# EAGLE design IO Shield (EAGLE 6.4)
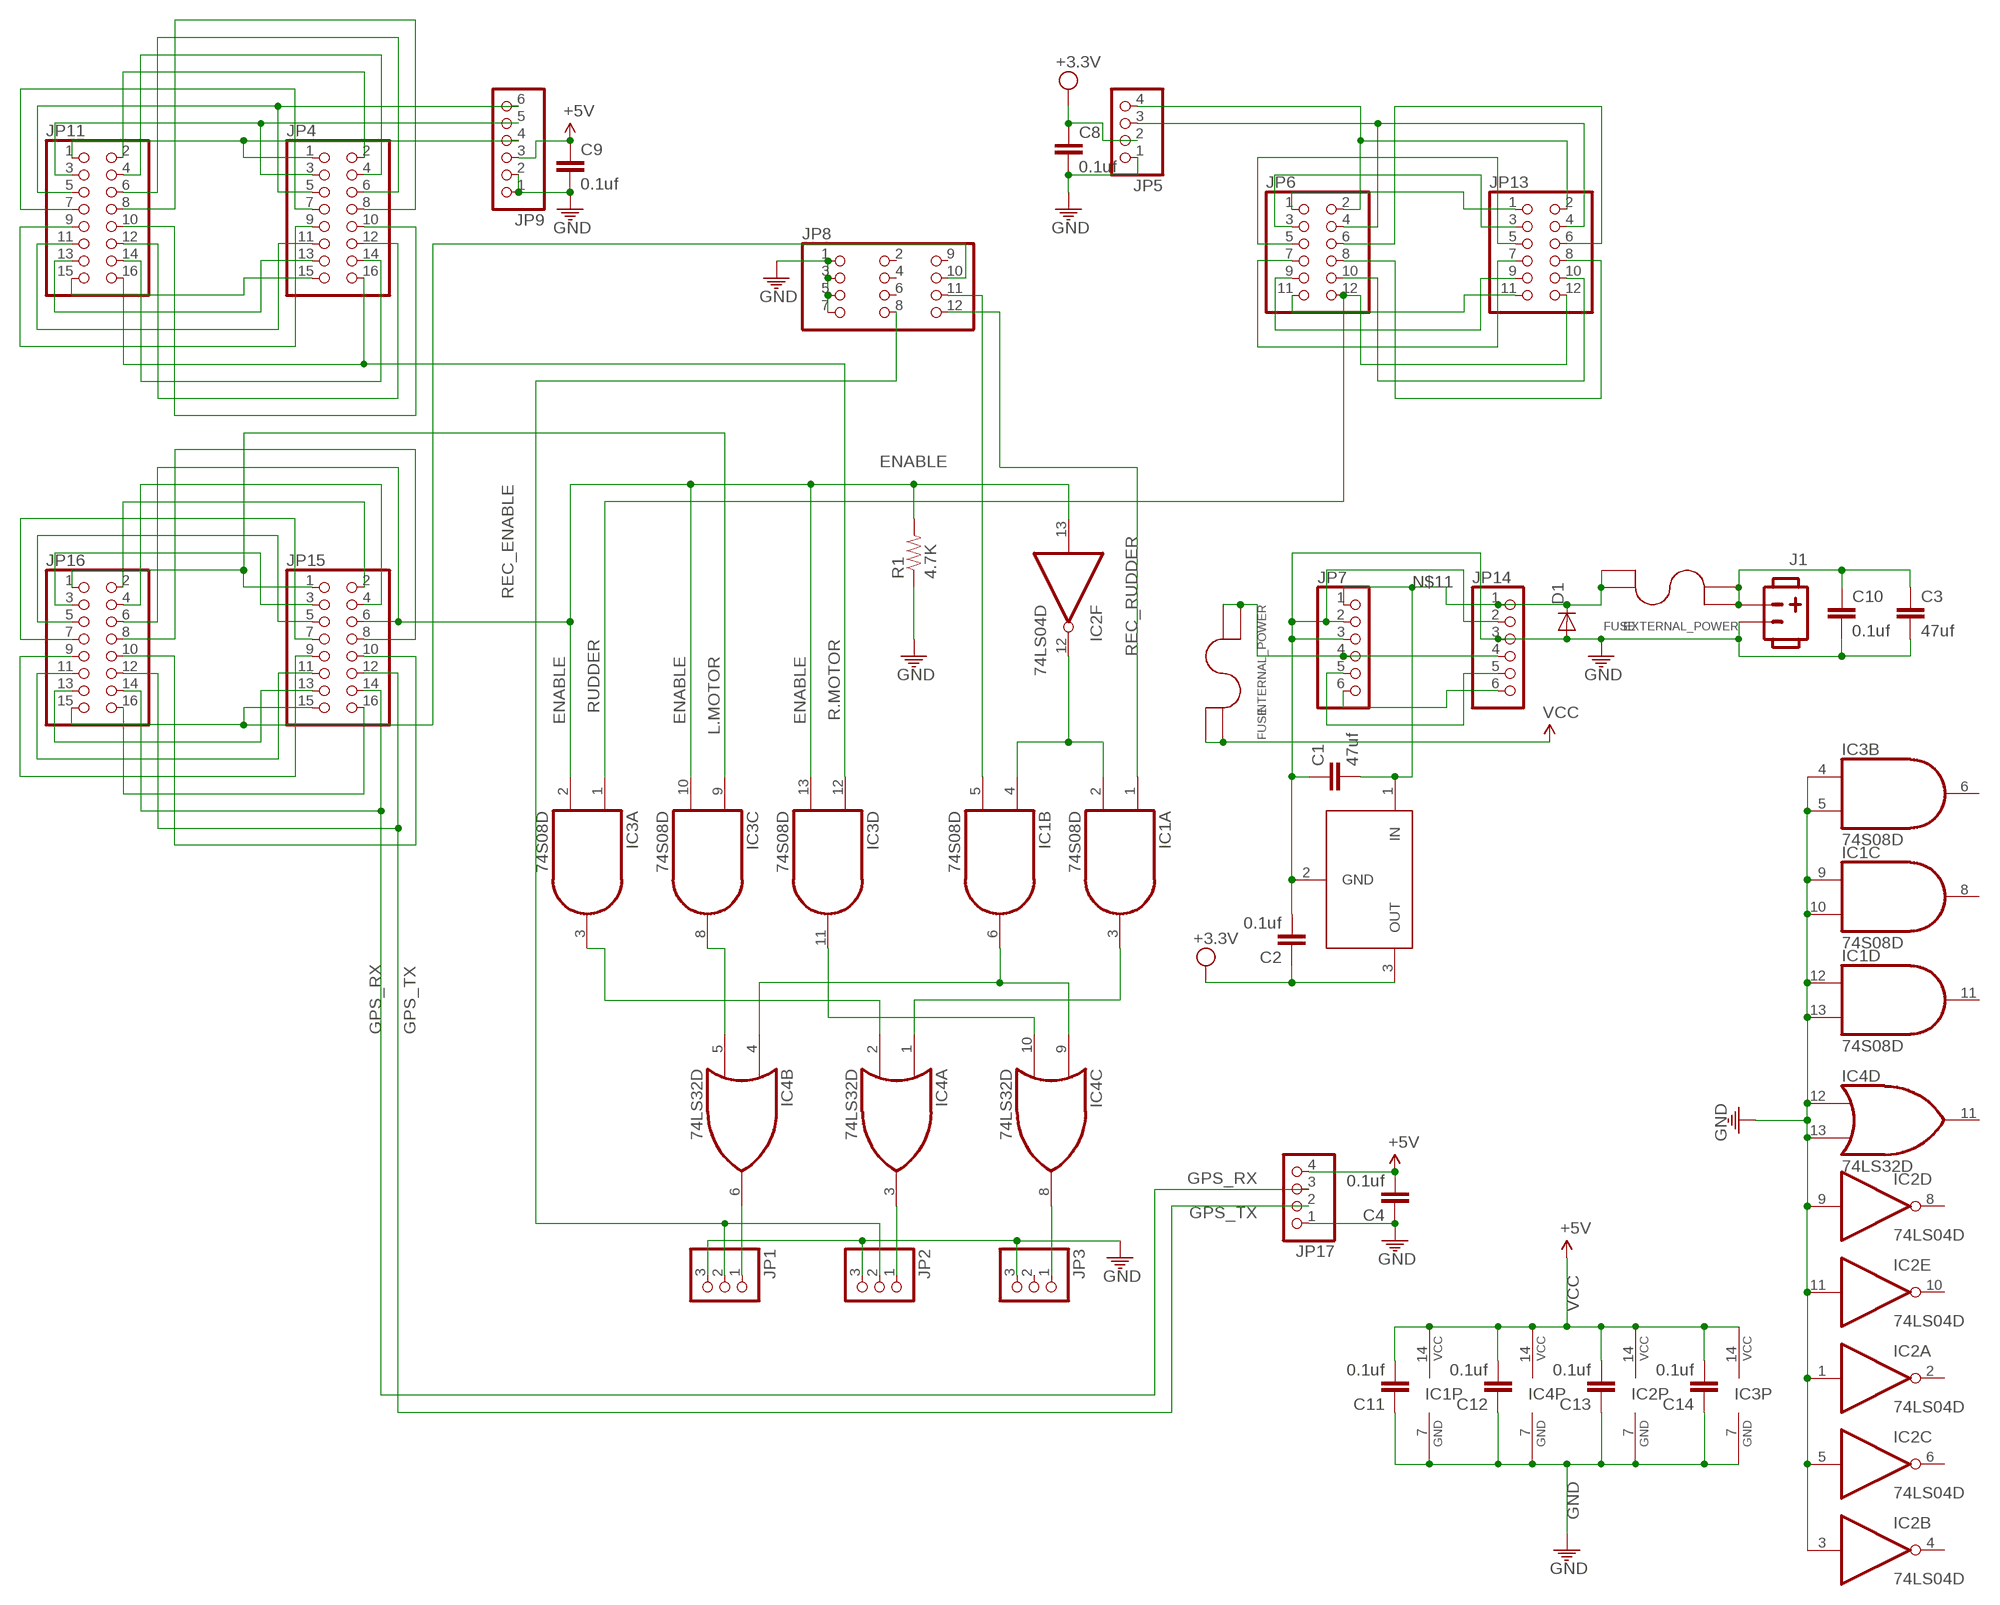
[diagram p0: schematic, sheet 1]

## Parts
C1  47uf  C-EUC0805  [C0805]
C2  0.1uf  C-EUC0805  [C0805]
C3  47uf  C-EUC0805  [C0805]
C4  0.1uf  C-EUC0805  [C0805]
C8  0.1uf  C-EUC0805  [C0805]
C9  0.1uf  C-EUC0805  [C0805]
C10  0.1uf  C-EUC0805  [C0805]
C11  0.1uf  C-EUC0805  [C0805]
C12  0.1uf  C-EUC0805  [C0805]
C13  0.1uf  C-EUC0805  [C0805]
C14  0.1uf  C-EUC0805  [C0805]
D1  DIODEPTH  [DIODE-1N4001]
EXTERNAL_POWER  FUSE  [FUSE_2AG]
IC1  74S08D  [SO14]
IC2  74LS04D  [SO14]
IC3  74S08D  [SO14]
IC4  74LS32D  [SO14]
INTERNAL_POWER  FUSE  [FUSE_2AG]
J1  POW_CONNECTFEMALE-RA  [SOCKET-FEMALE_RA-3.96MM-2]
JP1  PINHD-1X3/90  [1X03/90]
JP2  PINHD-1X3/90  [1X03/90]
JP3  PINHD-1X3/90  [1X03/90]
JP4  PINHD-2X8  [2X08]
JP5  PINHD-1X4  [1X04]
JP6  PINHD-2X6  [2X06]
JP7  PINHD-1X6  [1X06]
JP8  PINHD-2X4  [2X04]
JP9  PINHD-1X6  [1X06]
JP11  PINHD-2X8  [2X08]
JP13  PINHD-2X6  [2X06]
JP14  PINHD-1X6  [1X06]
JP15  PINHD-2X8  [2X08]
JP16  PINHD-2X8  [2X08]
JP17  PINHD-1X4  [1X04]
R1  4.7K  RESISTOR0805-RES  [0805]
U$1  LM3940IMP-3.3  [SOT223]

## Nets
ENABLE: IC2.13(F:I) IC3.2(A:I1) IC3.10(C:I1) IC3.13(D:I1) JP15.6 JP16.6 R1.2
GND: C1.1 C2.2 C3.2 C4.1 C8.2 C9.2 C10.2 C11.1 C12.1 C13.1 C14.1 D1.A IC1.7(P:GND) IC1.9(C:I0) IC1.10(C:I1) IC1.12(D:I0) IC1.13(D:I1) IC2.1(A:I) IC2.3(B:I) IC2.5(C:I) IC2.7(P:GND) IC2.9(D:I) IC2.11(E:I) IC3.4(B:I0) IC3.5(B:I1) IC3.7(P:GND) IC4.7(P:GND) IC4.12(D:I0) IC4.13(D:I1) J1.2 JP1.3 JP2.3 JP3.3 JP5.1 JP7.2 JP7.3 JP8.1 JP8.3 JP8.5 JP8.7 JP9.1 JP9.2 JP14.2 JP14.3 JP17.1 R1.1 U$1.2(GND)
GPS_RX: JP15.14 JP16.14 JP17.3
GPS_TX: JP15.12 JP16.12 JP17.2
L.MOTOR: IC3.9(C:I0) JP15.1 JP16.1
N$1: IC1.3(A:O) IC4.1(A:I0)
N$2: IC1.6(B:O) IC4.4(B:I0) IC4.9(C:I0)
N$3: IC1.2(A:I1) IC1.4(B:I0) IC2.12(F:O)
N$4: JP4.1 JP9.4 JP11.1
N$5: IC3.11(D:O) IC4.10(C:I1)
N$6: IC3.8(C:O) IC4.5(B:I1)
N$7: IC3.3(A:O) IC4.2(A:I1)
N$8: IC4.6(B:O) JP1.1
N$9: IC4.3(A:O) JP2.1
N$10: IC4.8(C:O) JP3.1
N$11: C1.2 D1.C EXTERNAL_POWER.P$3 EXTERNAL_POWER.P$4 JP7.1 JP14.1 U$1.1(IN)
N$12: JP1.2 JP2.2 JP8.8
N$13: C3.1 C10.1 EXTERNAL_POWER.P$1 EXTERNAL_POWER.P$2 J1.1
N$14: JP8.10 JP15.15 JP16.15
N$15: JP6.1 JP13.1
N$17: JP4.3 JP9.5 JP11.3
N$18: JP4.5 JP9.6 JP11.5
N$19: JP4.7 JP11.7
N$20: JP4.15 JP11.15
N$21: JP4.13 JP11.13
N$22: JP4.11 JP11.11
N$23: JP4.9 JP11.9
N$24: JP4.2 JP11.2
N$25: JP4.4 JP11.4
N$26: JP4.6 JP11.6
N$27: JP4.8 JP11.8
N$28: JP4.14 JP11.14
N$29: JP4.12 JP11.12
N$30: JP4.10 JP11.10
N$31: JP6.3 JP13.3
N$32: JP15.3 JP16.3
N$33: JP15.5 JP16.5
N$34: JP15.7 JP16.7
N$36: JP15.13 JP16.13
N$37: JP15.11 JP16.11
N$38: JP15.9 JP16.9
N$39: JP15.2 JP16.2
N$40: JP15.4 JP16.4
N$41: JP6.5 JP13.5
N$42: JP15.8 JP16.8
N$44: INTERNAL_POWER.P$1 INTERNAL_POWER.P$2 JP7.4 JP14.4
N$45: JP15.10 JP16.10
N$46: JP6.7 JP13.7
N$47: JP6.9 JP13.9
N$48: JP6.11 JP13.11
N$49: JP5.4 JP6.2 JP13.2
N$50: JP5.3 JP6.4 JP13.4
N$51: JP6.6 JP13.6
N$52: JP6.8 JP13.8
N$53: JP6.10 JP13.10
N$58: JP7.5 JP14.5
N$59: JP7.6 JP14.6
R.MOTOR: IC3.12(D:I0) JP4.16 JP11.16
REC.MOTOR: IC1.5(B:I1) JP8.11
REC_ENABLE: JP15.16 JP16.16
REC_RUDDER: IC1.1(A:I0) JP8.12
RUDDER: IC3.1(A:I0) JP6.12 JP13.12
VCC: C4.2 C9.1 C11.2 C12.2 C13.2 C14.2 IC1.14(P:VCC) IC2.14(P:VCC) IC3.14(P:VCC) IC4.14(P:VCC) INTERNAL_POWER.P$3 INTERNAL_POWER.P$4 JP9.3 JP17.4 ; supply symbol labelled +5V
VDD: C2.1 C8.1 JP5.2 U$1.3(OUT) ; supply symbol labelled +3.3V
Unconnected: IC1.8(C:O) IC1.11(D:O) IC2.2(A:O) IC2.4(B:O) IC2.6(C:O) IC2.8(D:O) IC2.10(E:O) IC3.6(B:O) IC4.11(D:O) JP3.2 JP8.2 JP8.4 JP8.6 JP8.9

## Library data of the parts
C1-C4 C8-C14 = resistor:C-EU: CAPACITOR, European symbol
D1 = ASL:DIODE: Diode These are standard reverse protection diodes and small signal diodes. SMA package can handle up to about 1A. SOD-323 can handle about 200mA. What the SOD-323 package when ordering, there are some mfgs out there that are 5-pin packages.
EXTERNAL_POWER INTERNAL_POWER = ASL:FUSE
IC1 IC3 = 74xx-us:74*08: Quad 2-input AND gate
IC2 = 74xx-us:74*04: Hex INVERTER
IC4 = 74xx-us:74*32: Quad 2-input OR gate
J1 = ASL:POW_CONNECT
JP1-JP3 = pinhead:PINHD-1X3: PIN HEADER
JP4 JP11 JP15 JP16 = pinhead:PINHD-2X8: PIN HEADER
JP5 = SDLogger:PINHD-1X4: PIN HEADER
JP6 JP13 = pinhead:PINHD-2X6: PIN HEADER
JP7 JP14 = pinhead:PINHD-1X6: PIN HEADER
JP8 = pinhead:PINHD-2X4: PIN HEADER
JP9 = SDLogger:PINHD-1X6: PIN HEADER
JP17 = pinhead:PINHD-1X4: PIN HEADER
R1 = ASL:RESISTOR: Resistor Basic schematic elements and footprints for 0603, 1206, and PTH resistors.
U$1 = LM3940:LM3940IMP-3.3: 1A Low Dropout Regulator for 5V to 3.3V Conversion

## Board
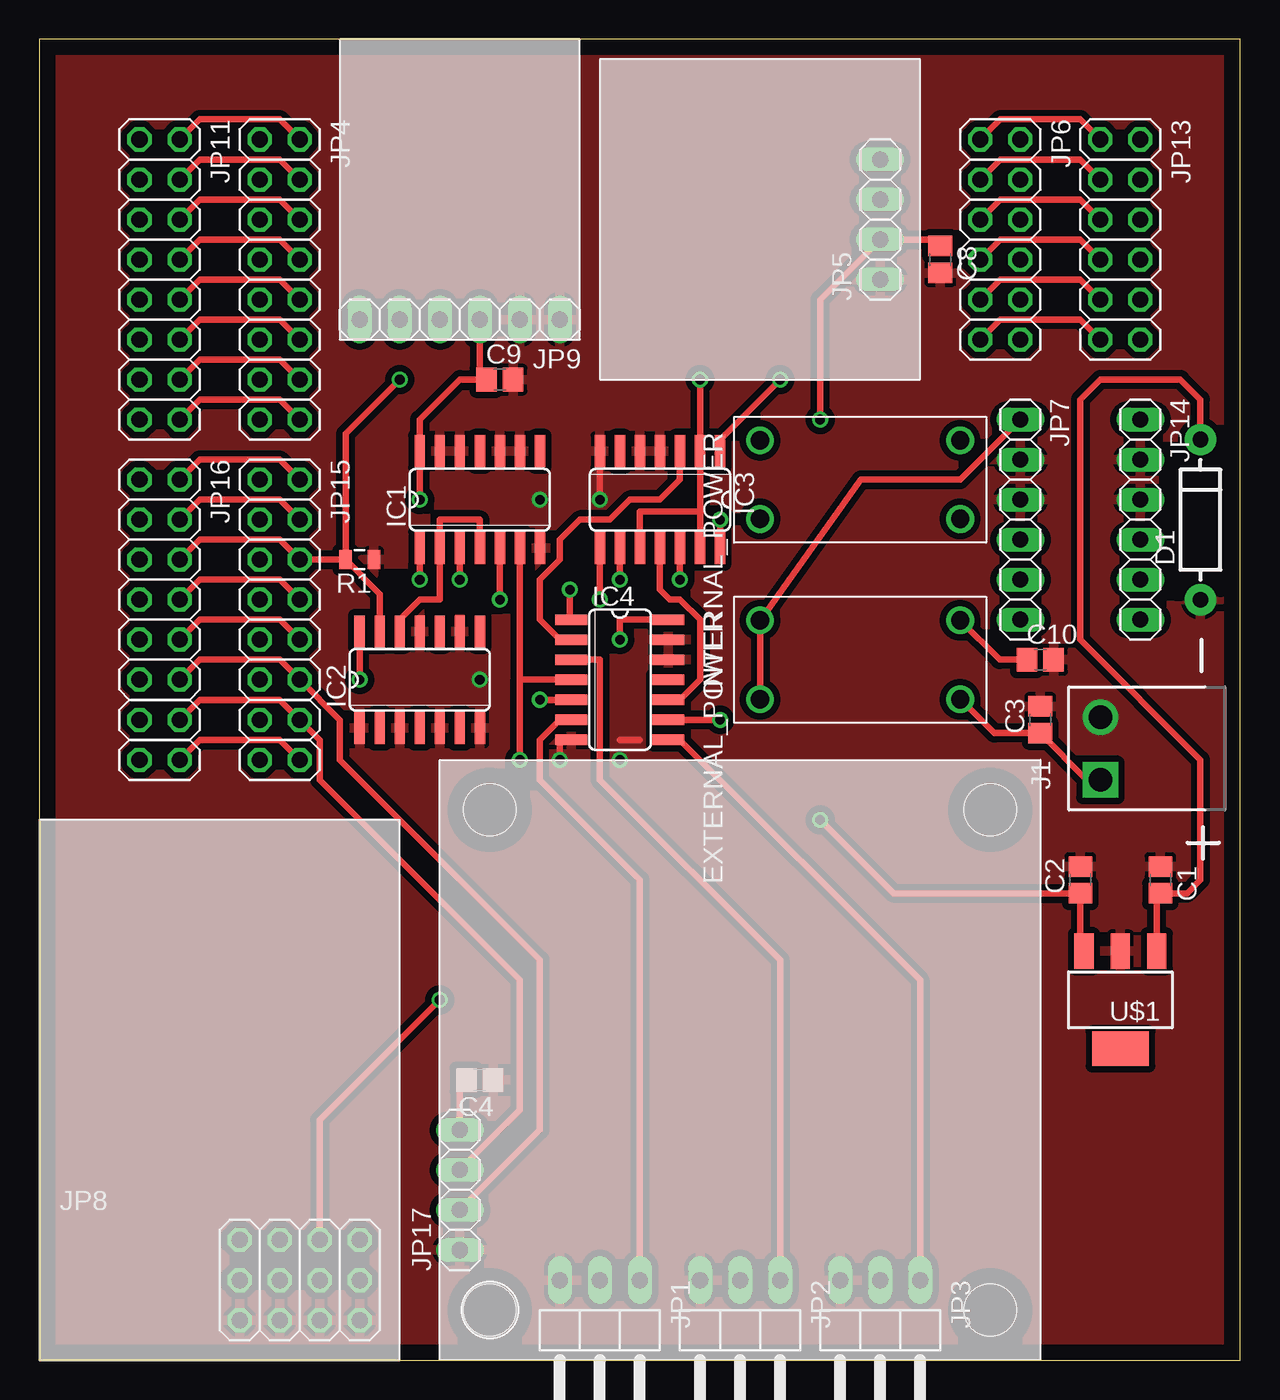
[diagram p1: board, top side]
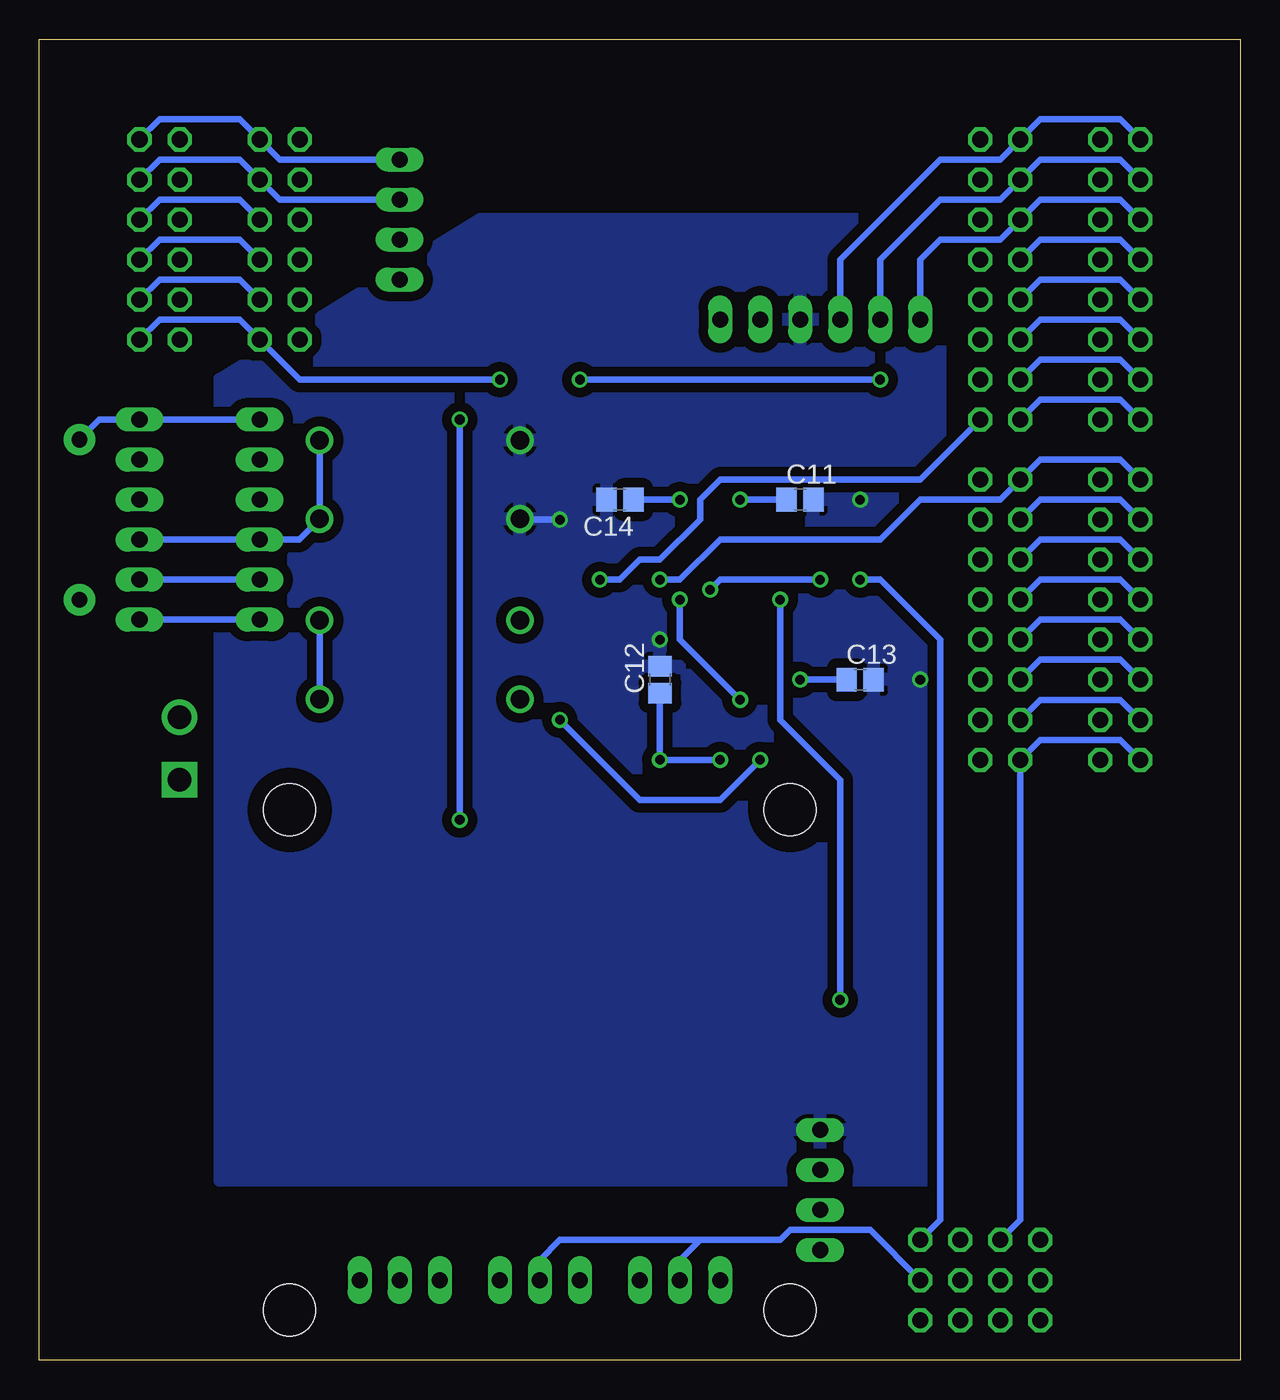
[diagram p2: board, bottom side, seen from below]

Size 76.2 x 83.82 mm. Coordinates in mm from the lower left corner, seen from the top.
Outline: 0,0 76.2,0 76.2,83.82 0,83.82 0,0
Copper layers (1*16): Top 0.035mm / dielectric 1.5mm / Bottom 0.035mm
Design rules "default": minimum track width 10mil, minimum drill 24mil, track to track 8mil, track to pad 8mil, pad to pad 8mil, via to via 8mil, smd to smd 8mil, copper to edge 40mil, drill to drill 8mil, minimum pad ring 10mil, minimum via ring 8mil, stop-mask expansion 4mil, vias tented up to drill 0mil, thermal gap 10mil
tRestrict: area 26.2,47.8 to 28.4,48.8; area 22.1,48 to 23.4,49.8; area 71.6,48.8 to 74.9,57.7

### Footprints (pad centres in the part's own frame; a part is rotated, then mirrored left to right if it is on the bottom)
C0805 = smd 1.3 x 1.5: 1 -0.85,0; 2 0.85,0
DIODE-1N4001 = drill 1 pad 1.981: A -5.08,0; C 5.08,0
FUSE_2AG = drill 1.17: P$1 -2.5,6.35; P$2 2.5,6.35; P$3 -2.5,-6.35; P$4 2.5,-6.35
SO14 = smd 0.66 x 2.032: 1 -3.81,-3.073; 2 -2.54,-3.073; 3 -1.27,-3.073; 4 0,-3.073; 5 1.27,-3.073; 6 2.54,-3.073; 7 3.81,-3.073; 8 3.81,3.073; 9 2.54,3.073; 10 1.27,3.073; 11 0,3.073; 12 -1.27,3.073; 13 -2.54,3.073; 14 -3.81,3.073
SOCKET-FEMALE_RA-3.96MM-2 = drill 1.5 square: 1 0,0 | drill 1.5: 2 3.96,0
1X03/90 = drill 1.016 long: 1 -2.54,-3.81; 2 0,-3.81; 3 2.54,-3.81
2X08 = drill 1.016 octagon: 1 -8.89,-1.27; 2 -8.89,1.27; 3 -6.35,-1.27; 4 -6.35,1.27; 5 -3.81,-1.27; 6 -3.81,1.27; 7 -1.27,-1.27; 8 -1.27,1.27; 9 1.27,-1.27; 10 1.27,1.27; 11 3.81,-1.27; 12 3.81,1.27; 13 6.35,-1.27; 14 6.35,1.27; 15 8.89,-1.27; 16 8.89,1.27
1X04 = drill 1.016 long: 1 -3.81,0; 2 -1.27,0; 3 1.27,0; 4 3.81,0
2X06 = drill 1.016 octagon: 1 -6.35,-1.27; 2 -6.35,1.27; 3 -3.81,-1.27; 4 -3.81,1.27; 5 -1.27,-1.27; 6 -1.27,1.27; 7 1.27,-1.27; 8 1.27,1.27; 9 3.81,-1.27; 10 3.81,1.27; 11 6.35,-1.27; 12 6.35,1.27
1X06 = drill 1.016 long: 1 -6.35,0; 2 -3.81,0; 3 -1.27,0; 4 1.27,0; 5 3.81,0; 6 6.35,0
2X04 = drill 1.016 octagon: 1 6.35,-1.27; 2 6.35,1.27; 3 8.89,-1.27; 4 8.89,1.27; 5 11.43,-1.27; 6 11.43,1.27; 7 13.97,-1.27; 8 13.97,1.27; 9 6.35,3.81; 10 8.89,3.81; 11 11.43,3.81; 12 13.97,3.81
1X04' = drill 1.016 long: 1 -3.175,0; 2 -0.635,0; 3 1.905,0; 4 4.445,0
0805 = smd 0.8 x 1.2: 1 -0.9,0; 2 0.9,0
SOT223 = smd 1.219 x 2.235: 1 -2.311,-3.099; 2 0,-3.099; 3 2.311,-3.099 | smd 3.6 x 2.2: 4 0,3.099
STAND-OFF = hole 3.302: 0,0

### Placement (x,y rotation side)
C1  71.12,30.48 270 top
C2  66.04,30.48 90 top
C3  63.5,40.64 90 top
C4  27.94,17.78 180 top
C8  57.15,69.85 270 top
C9  29.21,62.23 0 top
C10  63.5,44.45 0 top
C11  27.94,54.61 0 bottom
C12  36.83,43.18 90 bottom
C13  24.13,43.18 0 bottom
C14  39.37,54.61 180 bottom
D1  73.66,53.34 90 top
EXTERNAL_POWER  52.07,44.45 270 top
IC1  27.94,54.61 0 top
IC2  24.13,43.18 0 top
IC3  39.37,54.61 180 top
IC4  36.83,43.18 270 top
INTERNAL_POWER  52.07,55.88 270 top
J1  67.31,36.83 90 top
JP1  35.56,1.27 180 top
JP2  44.45,1.27 180 top
JP3  53.34,1.27 180 top
JP4  15.24,68.58 270 top
JP5  53.34,72.39 90 top
JP6  60.96,71.12 270 top
JP7  62.23,53.34 270 top
JP8  6.35,3.81 0 top
JP9  26.67,66.04 180 top
JP11  7.62,68.58 270 top
JP13  68.58,71.12 270 top
JP14  69.85,53.34 270 top
JP15  15.24,46.99 270 top
JP16  7.62,46.99 270 top
JP17  [1X04']  26.67,10.16 90 top
R1  20.32,50.8 180 top
U$1  68.58,22.86 180 top
U$2  [STAND-OFF]  60.33,3.17 0 top
U$3  [STAND-OFF]  28.58,3.17 0 top
U$4  [STAND-OFF]  28.58,34.93 0 top
U$5  [STAND-OFF]  60.33,34.93 0 top

### Tracks (layer width: path | path; a pad name or v marks a point on that pad's centre or on a via)
ENABLE  (via drill 0.61)
  Top 0.406: JP16.6 10.16,52.07 15.24,52.07 JP15.6 R1.2 | 41.91,53.85 IC3.13 | IC3.10 38.1,53.85 41.91,53.85 | v41.91,62.23 IC3.2 41.91,53.85 | R1.2 19.42,58.79 v22.86,62.23 | IC2.13 21.59,48.63 R1.2
  Bottom 0.406: v22.86,62.23 v41.91,62.23
GND  (via drill 0.61)
  Top 0.406: 36.83,39.37 38.1,39.37 | IC4.7 33.02,39.37 v33.02,38.1 | v35.56,54.61 IC3.7
  Bottom 0.406: v33.02,38.1 v36.83,38.1 C12.1 | C11.1 v31.75,54.61 | C13.1 v27.94,43.18 | C14.1 v35.56,54.61
  pour Top (isolate 0.406): 76.2,0 0,0 0,83.82 76.2,83.82
GPS_RX
  Top 0.406: JP16.14 10.16,41.91 15.24,41.91 JP15.14 17.78,39.37 17.78,36.83 30.48,24.13 30.48,15.88 JP17.3
GPS_TX
  Top 0.406: JP16.12 10.16,44.45 15.24,44.45 JP15.12 19.05,40.64 19.05,38.1 31.75,25.4 31.75,14.61 JP17.2
L.MOTOR  (via drill 0.61)
  Top 0.406: v36.83,49.53 IC3.9
  Bottom 0.406: JP16.1 7.62,57.15 12.7,57.15 JP15.1 15.24,54.61 20.32,54.61 22.86,52.07 33.02,52.07 35.56,49.53 v36.83,49.53
N$1  (via drill 0.61)
  Top 0.406: 26.67,50.8 IC1.3 v26.67,49.53 | IC4.1 33.66,46.99 v33.66,48.9
  Bottom 0.406: v33.66,48.9 33.02,49.53 v26.67,49.53
N$2  (via drill 0.61)
  Top 0.406: IC1.6 30.48,43.18 | 30.48,43.18 IC4.4 | v30.48,38.1 30.48,43.18 | v43.18,40.64 IC4.9
  Bottom 0.406: v43.18,40.64 38.1,35.56 33.02,35.56 v30.48,38.1
N$3
  Top 0.406: 27.94,50.8 IC1.4 27.94,53.34 25.4,53.34 IC1.2 25.4,48.26 24.13,48.26 22.86,46.99 IC2.12
N$4
  Bottom 0.406: JP11.1 7.62,78.74 12.7,78.74 JP4.1 15.24,76.2 19.05,76.2 25.4,69.85 JP9.4
N$5
  Top 0.406: IC4.10 40.64,41.91 41.91,43.18 41.91,46.99 40.64,48.26 40.01,48.26 39.37,48.9 IC3.11
N$6  (via drill 0.61)
  Top 0.406: IC3.8 v35.56,48.26 | v31.75,41.91 IC4.5
  Bottom 0.406: v35.56,48.26 35.56,45.72 v31.75,41.91
N$7
  Top 0.406: IC3.3 40.64,55.88 39.37,54.61 37.47,54.61 36.2,53.34 34.29,53.34 33.02,52.07 33.02,50.8 31.75,49.53 31.75,46.99 33.02,45.72 IC4.2
N$8
  Top 0.406: IC4.6 33.02,40.64 31.75,39.37 31.75,36.83 38.1,30.48 JP1.1
N$9
  Top 0.406: 46.99,5.93 JP2.1 46.99,25.4 35.56,36.83 35.56,44.45 IC4.3
N$10
  Top 0.406: IC4.8 40.64,39.37 55.88,24.13 JP3.1
N$11
  Top 0.406: U$1.1 70.89,29.4 C1.2 72.81,29.63 73.66,30.48 73.66,38.1 66.04,45.72 66.04,60.96 67.31,62.23 72.39,62.23 73.66,60.96 D1.C | JP7.1 58.42,55.88 52.11,55.88 EXTERNAL_POWER.P$3 EXTERNAL_POWER.P$4
  Bottom 0.406: JP7.1 JP14.1 72.39,59.69 D1.C
N$12
  Bottom 0.406: JP2.2 44.45,6.35 43.18,7.62 34.29,7.62 | 34.29,7.62 29.21,7.62 28.58,8.26 23.49,8.26 JP8.8 | JP1.2 35.56,6.35 34.29,7.62
N$13
  Top 0.406: J1.1 66.46,36.83 C3.1 60.58,39.79 EXTERNAL_POWER.P$2 | C10.1 60.92,44.45 EXTERNAL_POWER.P$1
  Bottom 0.406: EXTERNAL_POWER.P$1 EXTERNAL_POWER.P$2
N$14
  Bottom 0.406: JP16.15 7.62,39.37 12.7,39.37 JP15.15 13.97,8.89 JP8.10
N$15
  Top 0.406: JP6.1 60.96,78.74 66.04,78.74 JP13.1
N$17
  Bottom 0.406: JP11.3 7.62,76.2 12.7,76.2 JP4.3 15.24,73.66 19.05,73.66 22.86,69.85 JP9.5
N$18
  Bottom 0.406: JP11.5 7.62,73.66 12.7,73.66 JP4.5 15.24,71.12 19.05,71.12 20.32,69.85 JP9.6
N$19
  Bottom 0.406: JP11.7 7.62,71.12 12.7,71.12 JP4.7
N$20
  Bottom 0.406: JP11.15 7.62,60.96 12.7,60.96 JP4.15
N$21
  Bottom 0.406: JP11.13 7.62,63.5 12.7,63.5 JP4.13
N$22
  Bottom 0.406: JP11.11 7.62,66.04 12.7,66.04 JP4.11
N$23
  Bottom 0.406: JP11.9 7.62,68.58 12.7,68.58 JP4.9
N$24
  Top 0.406: JP11.2 10.16,78.74 15.24,78.74 JP4.2
N$25
  Top 0.406: JP11.4 10.16,76.2 15.24,76.2 JP4.4
N$26
  Top 0.406: JP11.6 10.16,73.66 15.24,73.66 JP4.6
N$27
  Top 0.406: JP11.8 10.16,71.12 15.24,71.12 JP4.8
N$28
  Top 0.406: JP11.14 10.16,63.5 15.24,63.5 JP4.14
N$29
  Top 0.406: JP11.12 10.16,66.04 15.24,66.04 JP4.12
N$30
  Top 0.406: JP11.10 10.16,68.58 15.24,68.58 JP4.10
N$31
  Top 0.406: JP13.3 66.04,76.2 60.96,76.2 JP6.3
N$32
  Bottom 0.406: JP16.3 7.62,54.61 12.7,54.61 JP15.3
N$33
  Bottom 0.406: JP16.5 7.62,52.07 12.7,52.07 JP15.5
N$34
  Bottom 0.406: JP16.7 7.62,49.53 12.7,49.53 JP15.7
N$36
  Bottom 0.406: JP16.13 7.62,41.91 12.7,41.91 JP15.13
N$37
  Bottom 0.406: JP16.11 7.62,44.45 12.7,44.45 JP15.11
N$38
  Bottom 0.406: JP16.9 7.62,46.99 12.7,46.99 JP15.9
N$39
  Top 0.406: JP16.2 10.16,57.15 15.24,57.15 JP15.2
N$40
  Top 0.406: JP16.4 10.16,54.61 15.24,54.61 JP15.4
N$41
  Top 0.406: JP13.5 66.04,73.66 60.96,73.66 JP6.5
N$42
  Top 0.406: JP16.8 10.16,49.53 15.24,49.53 JP15.8
N$44
  Bottom 0.406: JP14.4 JP7.4 59.73,52.07 INTERNAL_POWER.P$2 INTERNAL_POWER.P$1
N$45
  Top 0.406: JP16.10 10.16,46.99 15.24,46.99 JP15.10
N$46
  Top 0.406: JP13.7 66.04,71.12 60.96,71.12 JP6.7
N$47
  Top 0.406: JP13.9 66.04,68.58 60.96,68.58 JP6.9
N$48
  Top 0.406: JP13.11 66.04,66.04 60.96,66.04 JP6.11
N$49
  Bottom 0.406: JP13.2 68.58,78.74 63.5,78.74 JP6.2 60.96,76.2 JP5.4
N$50
  Bottom 0.406: JP13.4 68.58,76.2 63.5,76.2 JP6.4 60.96,73.66 JP5.3
N$51
  Bottom 0.406: JP13.6 68.58,73.66 63.5,73.66 JP6.6
N$52
  Bottom 0.406: JP13.8 68.58,71.12 63.5,71.12 JP6.8
N$53
  Bottom 0.406: JP13.10 68.58,68.58 63.5,68.58 JP6.10
N$58
  Bottom 0.406: JP7.5 JP14.5
N$59
  Bottom 0.406: JP7.6 JP14.6
R.MOTOR  (via drill 0.61)
  Top 0.406: JP11.16 10.16,60.96 15.24,60.96 JP4.16 | v40.64,49.53 IC3.12
  Bottom 0.406: JP4.16 20.32,55.88 33.02,55.88 34.29,54.61 34.29,53.34 36.83,50.8 38.1,50.8 39.37,49.53 v40.64,49.53
REC.MOTOR  (via drill 0.61)
  Top 0.406: JP8.11 17.78,15.24 v25.4,22.86 | v29.21,48.26 IC1.5
  Bottom 0.406: v29.21,48.26 29.21,40.64 25.4,36.83 v25.4,22.86
REC_ENABLE
  Top 0.406: JP16.16 10.16,39.37 15.24,39.37 JP15.16
REC_RUDDER  (via drill 0.61)
  Top 0.406: v24.13,49.53 IC1.1
  Bottom 0.406: JP8.12 19.05,8.89 19.05,45.72 22.86,49.53 v24.13,49.53
RUDDER  (via drill 0.61)
  Top 0.406: v46.99,62.23 43.18,58.42 IC3.1
  Bottom 0.406: JP13.12 68.58,66.04 63.5,66.04 JP6.12 59.69,62.23 v46.99,62.23
VCC  (via drill 0.61)
  Top 0.406: v20.32,43.18 IC2.14 | v24.13,54.61 IC1.14 24.13,59.69 26.67,62.23 C9.1 27.94,62.65 JP9.3 | IC4.14 36.83,46.99 v36.83,45.72 | C4.2 26.67,17.78 JP17.4 | IC3.14 v43.18,53.34
  Bottom 0.406: v43.18,53.34 45.68,53.34 INTERNAL_POWER.P$4
  pour Bottom (isolate 0.61): 64.77,11.43 19.05,11.43 19.05,72.39 48.26,72.39 64.77,62.23
VDD  (via drill 0.61)
  Top 0.406: C8.1 56.73,71.12 JP5.2 49.53,67.31 v49.53,59.69 | 66.27,26.86 66.27,26.67 | 66.27,26.67 U$1.3 | 66.27,26.67 66.04,26.9 C2.1 54.19,29.63 v49.53,34.29
  Bottom 0.406: v49.53,34.29 v49.53,59.69